# Altium schematic sheet Sheet_1_2022-03-11.schdoc
size 299 x 204 mm
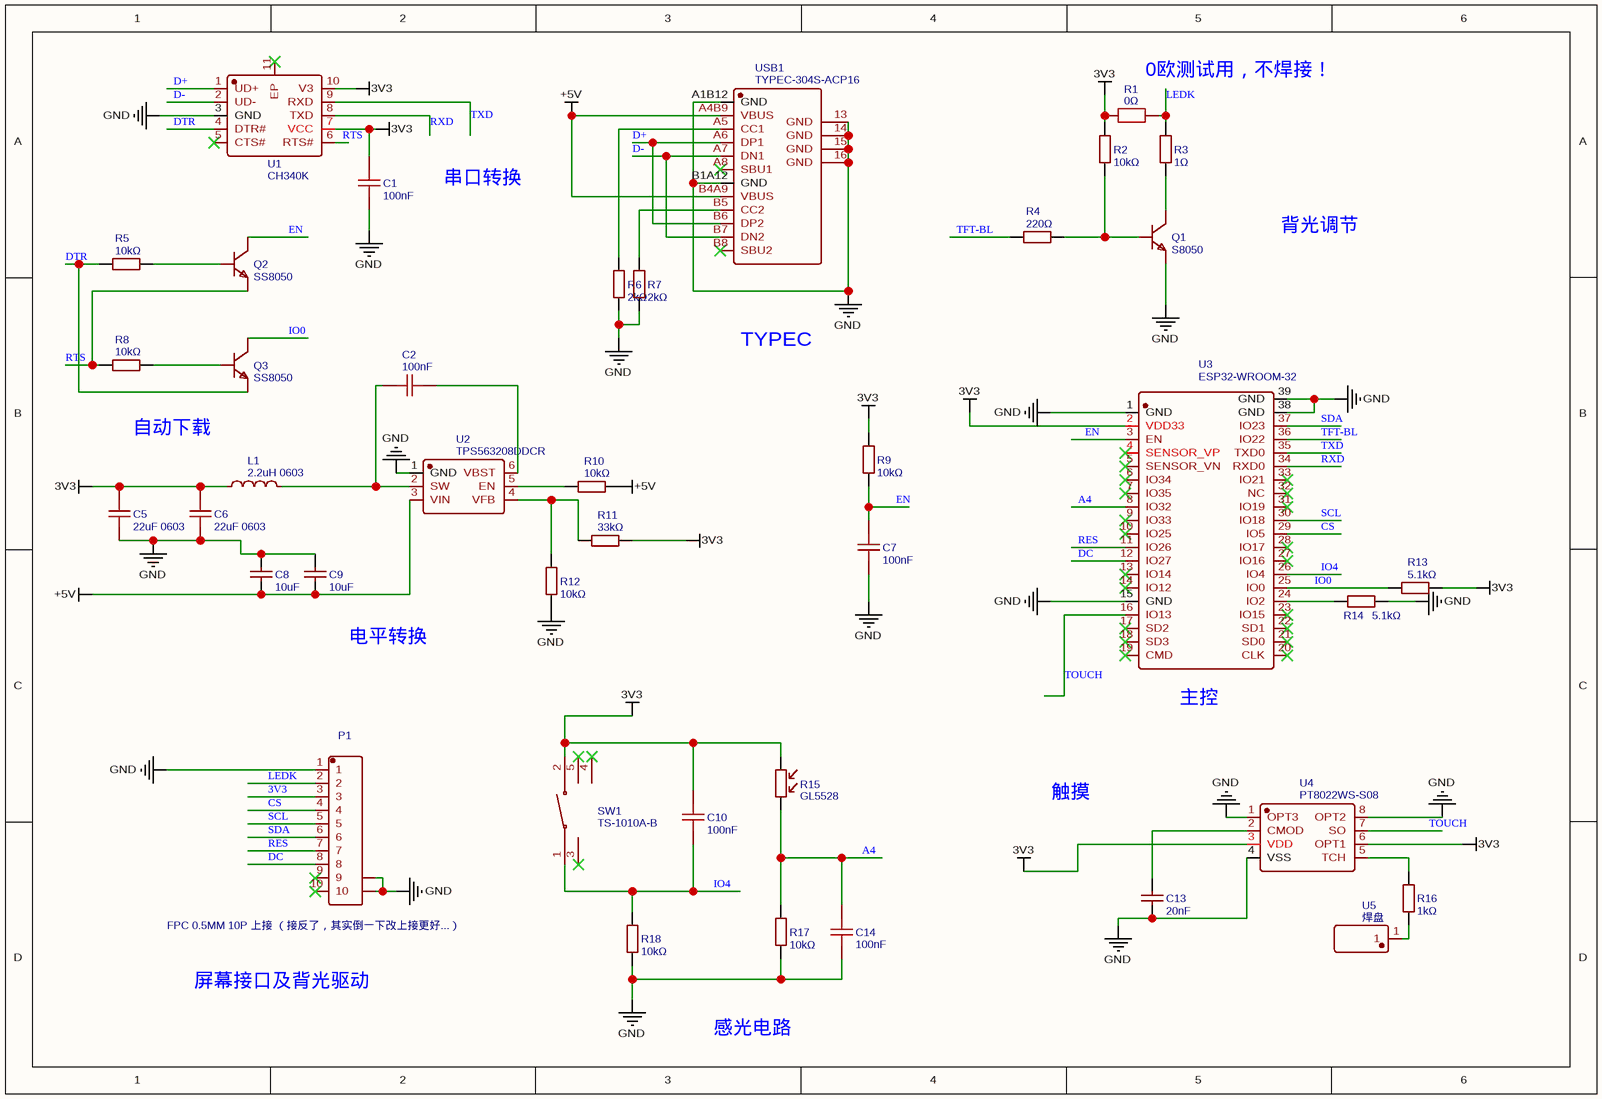
[diagram p0: Sheet_1_2022-03-11.schdoc]

## Parts
C1  100nF  [C0402]
C2  100nF  [C0402]
C5  22uF 0603  [C0603]
C6  22uF 0603  [C0603]
C7  100nF  [C0402]
C8  10uF  [C0402]
C9  10uF  [C0402]
C10  100nF  [C0402]
C13  20nF  [C0402]
C14  100nF  [C0402]
L1  2.2uH 0603  [L0603]
P1  FPC 0.5MM 10P 上接 （接反了，其实倒一下改上接更好...）  [FPC-SMD_FPC0.5MM10P]
Q1  S8050  [SOT-23-3_L2.9-W1.3-P1.90-LS2.4-BR]
Q2  SS8050  [SOT-23-3_L2.9-W1.3-P1.90-LS2.4-BR]
Q3  SS8050  [SOT-23-3_L2.9-W1.3-P1.90-LS2.4-BR]
R1  0Ω  [R0805]
R2  10kΩ  [R0402]
R3  1Ω  [R0402]
R4  220Ω  [R0603]
R5  10kΩ  [R0402]
R6  2kΩ  [R0402]
R7  2kΩ  [R0402]
R8  10kΩ  [R0402]
R9  10kΩ  [R0402]
R10  10kΩ  [R0402]
R11  33kΩ  [R0402]
R12  10kΩ  [R0402]
R13  5.1kΩ  [R0402]
R14  5.1kΩ  [R0402]
R15  GL5528  [RES-TH_L5.1-W4.3-P3.40-D0.5]
R16  1kΩ  [R0402]
R17  10kΩ  [R0402]
R18  10kΩ  [R0402]
SW1  TS-1010A-B  [SW-SMD_TS-1010A-B]
U1  CH340K  [ESOP-10_L4.9-W3.9-P1.00-LS6.2-BL-EP]
U2  TPS563208DDCR  [TSOT-23-6_L2.9-W1.6-P0.95-LS2.8-BL]
U3  ESP32-WROOM-32  [WIFIM-SMD_39P-L25.5-W18.0-P1.27]
U4  PT8022WS-S08  [SOP-8_L5.0-W4.0-P1.27-LS6.2-BL]
U5  焊盘  [焊盘]
USB1  TYPEC-304S-ACP16  [USB-C-SMD_TYPEC-304S-ACP16]

## Nets
3V3: C1.2 C5.2 C6.2 C10.2 L1.1 P1.3 R1.1 R2.2 R9.2 R11.2 R13.2 R15.1 SW1.2 U1.7(VCC) U1.10(V3) U3.2(VDD33) U4.3(VDD) U4.6(OPT1)
+5V: C8.1 C9.1 R10.2 U2.3(VIN) USB1.A4B9(VBUS) USB1.B4A9(VBUS)
GND: C1.1 C5.1 C6.1 C7.1 C8.2 C9.2 C13.2 C14.1 P1.1 P1.11 P1.12 Q1.2(E) R6.1 R7.1 R12.1 R14.2 R17.1 R18.1 U1.3(GND) U2.1(GND) U3.1(GND) U3.15(GND) U3.38(GND) U3.39(GND) U4.1(OPT3) U4.4(VSS) U4.8(OPT2) USB1.13(GND) USB1.14(GND) USB1.15(GND) USB1.16(GND) USB1.A1B12(GND) USB1.B1A12(GND)
A4: C14.2 R15.2 R17.2 U3.8(IO32)
CS: P1.4 U3.29(IO5)
D+: U1.1(UD+) USB1.A6(DP1) USB1.B6(DP2)
D-: U1.2(UD-) USB1.A7(DN1) USB1.B7(DN2)
DC: P1.8 U3.12(IO27)
DTR: Q3.2(E) R5.1 U1.4(DTR#)
EN: C7.2 Q2.3(C) R9.1 U3.3(EN)
IO0: Q3.3(C) R13.1 U3.25(IO0)
IO4: C10.1 R18.2 SW1.1 U3.26(IO4)
LEDK: P1.2 R1.2 R3.2
RES: P1.7 U3.11(IO26)
RTS: Q2.2(E) R8.2 U1.6(RTS#)
RXD: U1.8(TXD) U3.34(RXD0)
SCL: P1.5 U3.30(IO18)
SDA: P1.6 U3.37(IO23)
TFT-BL: R4.2 U3.36(IO22)
TOUCH: U3.16(IO13) U4.7(SO)
TXD: U1.9(RXD) U3.35(TXD0)
NetC2_1: C2.1 U2.6(VBST)
NetC2_2: C2.2 L1.2 U2.2(SW)
NetC13_1: C13.1 U4.2(CMOD)
NetQ1_1: Q1.1(B) R2.1 R4.1
NetQ1_3: Q1.3(C) R3.1
NetQ2_1: Q2.1(B) R5.2
NetQ3_1: Q3.1(B) R8.1
NetR6_2: R6.2 USB1.A5(CC1)
NetR7_2: R7.2 USB1.B5(CC2)
NetR10_1: R10.1 U2.5(EN)
NetR11_1: R11.1 R12.2 U2.4(VFB)
NetR14_1: R14.1 U3.24(IO2)
NetR16_1: R16.1 U5.1
NetR16_2: R16.2 U4.5(TCH)

Not connected (* = marked no-connect by the designer): P1 9* 10*; SW1 3* 4* 5*; U1 5(CTS#)* 11(EP)*; U3 4(SENSOR_VP)* 5(SENSOR_VN)* 6(IO34)* 7(IO35)* 9(IO33)* 10(IO25)* 13(IO14)* 14(IO12)* 17(SD2)* 18(SD3)* 19(CMD)* 20(CLK)* 21(SD0)* 22(SD1)* 23(IO15)* 27(IO16)* 28(IO17)* 31(IO19)* 32(NC)* 33(IO21)*; USB1 A8(SBU1)* B8(SBU2)*

## Notes on the sheet
- 0欧测试用，不焊接！
- 串口转换
- 背光调节
- TYPEC
- 自动下载
- 电平转换
- (near U3) 主控
- 触摸
- 屏幕接口及背光驱动
- 感光电路

## Library data of the parts
C1 C2 C7 C10 C14 = 100nF: BOM_Manufacturer: Samsung Electro-Mechanics; BOM_Manufacturer Part: CL05B104KB54PNC; nameAlias: Capacitance; Contributor: LCSC; BOM_Supplier: LCSC; BOM_Supplier Part: C307331; BOM_JLCPCB Part Class: Basic Part; spicePre: C; spiceSymbolName: CL05B104KB54PNC
C5 C6 = 22uF 0603: nameAlias: Value(F); Contributor: LCEDA_Lib; spicePre: C; spiceSymbolName: C_0402_US
C8 C9 = 10uF: BOM_Manufacturer Part: CL05A106MQ5NUNC; BOM_Manufacturer: SAMSUNG; nameAlias: Capacitance; BOM_Supplier: LCSC; BOM_Supplier Part: C15525; BOM_JLCPCB Part Class: Basic Part; spicePre: C; spiceSymbolName: CL05A106MQ5NUNC
C13 = 20nF: BOM_Manufacturer: FH; BOM_Manufacturer Part: 0402F203M500NT; nameAlias: Capacitance; BOM_Supplier: LCSC; BOM_Supplier Part: C79469; BOM_JLCPCB Part Class: Extended Part; spicePre: C; spiceSymbolName: 0402F203M500NT
L1 = 2.2uH 0603: nameAlias: Value(H); Contributor: LCEDA_Lib; spicePre: L; spiceSymbolName: L0603_US
P1 = FPC 0.5MM 10P 上接 （接反了，其实倒一下改上接更好...）: BOM_Manufacturer: BOOMELE; BOM_Manufacturer Part: FPC 0.5MM 10P Pull type H2.0mm Pick up; BOM_Paste Type: Extended Part; spicePre: X; BOM_Supplier: LCSC; BOM_Supplier Part: C11085; BOM_JLCPCB Part Class: Extended Part; JLCPCB Part Class: Extended Part; spiceSymbolName: FPC 0.5MM 10P Pull type H2.0mm Pick up
Q1 = S8050: BOM_Manufacturer: JSMSEMI; Contributor: LCSC; BOM_Supplier: LCSC; BOM_Supplier Part: C916390; BOM_Manufacturer Part: S8050; BOM_JLCPCB Part Class: Extended Part; spicePre: Q; spiceSymbolName: S8050
Q2 Q3 = SS8050: BOM_Manufacturer: WPMtek(维攀微); Contributor: LCSC; BOM_Supplier: LCSC; BOM_Supplier Part: C2688219; BOM_Manufacturer Part: SS8050; BOM_JLCPCB Part Class: Extended Part; spicePre: Q; spiceSymbolName: SS8050
R1 = 0Ω: nameAlias: Value(Ω); Contributor: LCEDA_Lib; spicePre: R; spiceSymbolName: R_0805_EU
R2 R5 R8-R10 R12 R17 R18 = 10kΩ: BOM_Manufacturer: UniOhm; BOM_Manufacturer Part: 0402WGF1002TCE; nameAlias: Resistance; Resistance (Ohms): 10K; BOM_Supplier: LCSC; BOM_Supplier Part: C25744; BOM_JLCPCB Part Class: Basic Part; spicePre: R; spiceSymbolName: 0402WGF1002TCE
R3 = 1Ω: BOM_Manufacturer: UniOhm; BOM_Manufacturer Part: 0402WGF100KTCE; nameAlias: Resistance; Resistance (Ohms): 1; BOM_Supplier: LCSC; BOM_Supplier Part: C25086; BOM_JLCPCB Part Class: Basic Part; spicePre: R; spiceSymbolName: 0402WGF100KTCE
R4 = 220Ω: BOM_Manufacturer: UniOhm; BOM_Manufacturer Part: 0603WAF2200T5E; nameAlias: Resistance; Resistance (Ohms): 220; BOM_Supplier: LCSC; BOM_Supplier Part: C22962; BOM_JLCPCB Part Class: Basic Part; spicePre: R; spiceSymbolName: 0603WAF2200T5E
R6 R7 = 2kΩ: BOM_Manufacturer Part: 0402WGF2001TCE; BOM_Manufacturer: UniOhm; nameAlias: Resistance; Resistance (Ohms): 2K; BOM_Supplier: LCSC; BOM_Supplier Part: C4109; BOM_JLCPCB Part Class: Basic Part; spicePre: R; spiceSymbolName: 0402WGF2001TCE
R11 = 33kΩ: BOM_Manufacturer: UniOhm; BOM_Manufacturer Part: 0402WGF3302TCE; nameAlias: Resistance; Resistance (Ohms): 33K; BOM_Supplier: LCSC; BOM_Supplier Part: C25779; BOM_JLCPCB Part Class: Basic Part; spicePre: R; spiceSymbolName: 0402WGF3302TCE
R13 R14 = 5.1kΩ: BOM_Manufacturer: UniOhm; BOM_Manufacturer Part: 0402WGF5101TCE; nameAlias: Resistance; Resistance (Ohms): 5.1K; BOM_Supplier: LCSC; BOM_Supplier Part: C25905; BOM_JLCPCB Part Class: Basic Part; spicePre: R; spiceSymbolName: 0402WGF5101TCE
R15 = GL5528: BOM_Manufacturer: Senba; BOM_Supplier: LCSC; BOM_Manufacturer Part: GL5528; BOM_Supplier Part: C125627; BOM_JLCPCB Part Class: Extended Part; spicePre: R; spiceSymbolName: GL5528
R16 = 1kΩ: BOM_Manufacturer: UniOhm; BOM_Manufacturer Part: 0402WGF1001TCE; nameAlias: Resistance; Resistance (Ohms): 1K; BOM_Supplier: LCSC; BOM_Supplier Part: C11702; BOM_JLCPCB Part Class: Basic Part; spicePre: R; spiceSymbolName: 0402WGF1001TCE
SW1 = TS-1010A-B: BOM_Manufacturer: XKB Enterprise; Contributor: LCSC; BOM_Supplier: LCSC; BOM_Supplier Part: C381059; BOM_Manufacturer Part: TS-1010A-B; BOM_JLCPCB Part Class: Extended Part; spicePre: S; spiceSymbolName: TS-1010A-B
U1 = CH340K: BOM_Manufacturer: WCH(Jiangsu Qin Heng); Contributor: LCSC; BOM_Supplier: LCSC; BOM_Supplier Part: C968586; BOM_Manufacturer Part: CH340K; BOM_JLCPCB Part Class: Extended Part; spicePre: U; spiceSymbolName: CH340K
U2 = TPS563208DDCR: BOM_Manufacturer: Texas Instruments; Contributor: LCSC; BOM_Supplier: LCSC; BOM_Supplier Part: C468250; BOM_Manufacturer Part: TPS563208DDCR; BOM_JLCPCB Part Class: Extended Part; spicePre: U; spiceSymbolName: TPS563208DDCR
U3 = ESP32-WROOM-32: BOM_Manufacturer: Espressif Systems; Contributor: LCSC; BOM_Supplier: LCSC; BOM_Supplier Part: C503587; BOM_Manufacturer Part: ESP32-WROOM-32; spicePre: U; spiceSymbolName: ESP32-WROOM-32
U4 = PT8022WS-S08: BOM_Manufacturer: PinTENG(品腾); Contributor: LCSC; BOM_Supplier: LCSC; BOM_Supplier Part: C2936083; BOM_Manufacturer Part: PT8022WS-S08; spicePre: U; spiceSymbolName: PT8022WS-S08
U5 = 焊盘: BOM_Manufacturer Part: New SchematicLib; Contributor: Kisro; spicePre: U; spiceSymbolName: 焊盘
USB1 = TYPEC-304S-ACP16: BOM_Manufacturer: XUNPU; Contributor: LCSC; BOM_Supplier: LCSC; BOM_Supplier Part: C720630; BOM_Manufacturer Part: TYPEC-304S-ACP16; BOM_JLCPCB Part Class: Extended Part; spicePre: U; spiceSymbolName: TYPEC-304S-ACP16